# Altium schematic sheet USB.SchDoc
size D; SheetNumber: 5; SheetTotal: 11
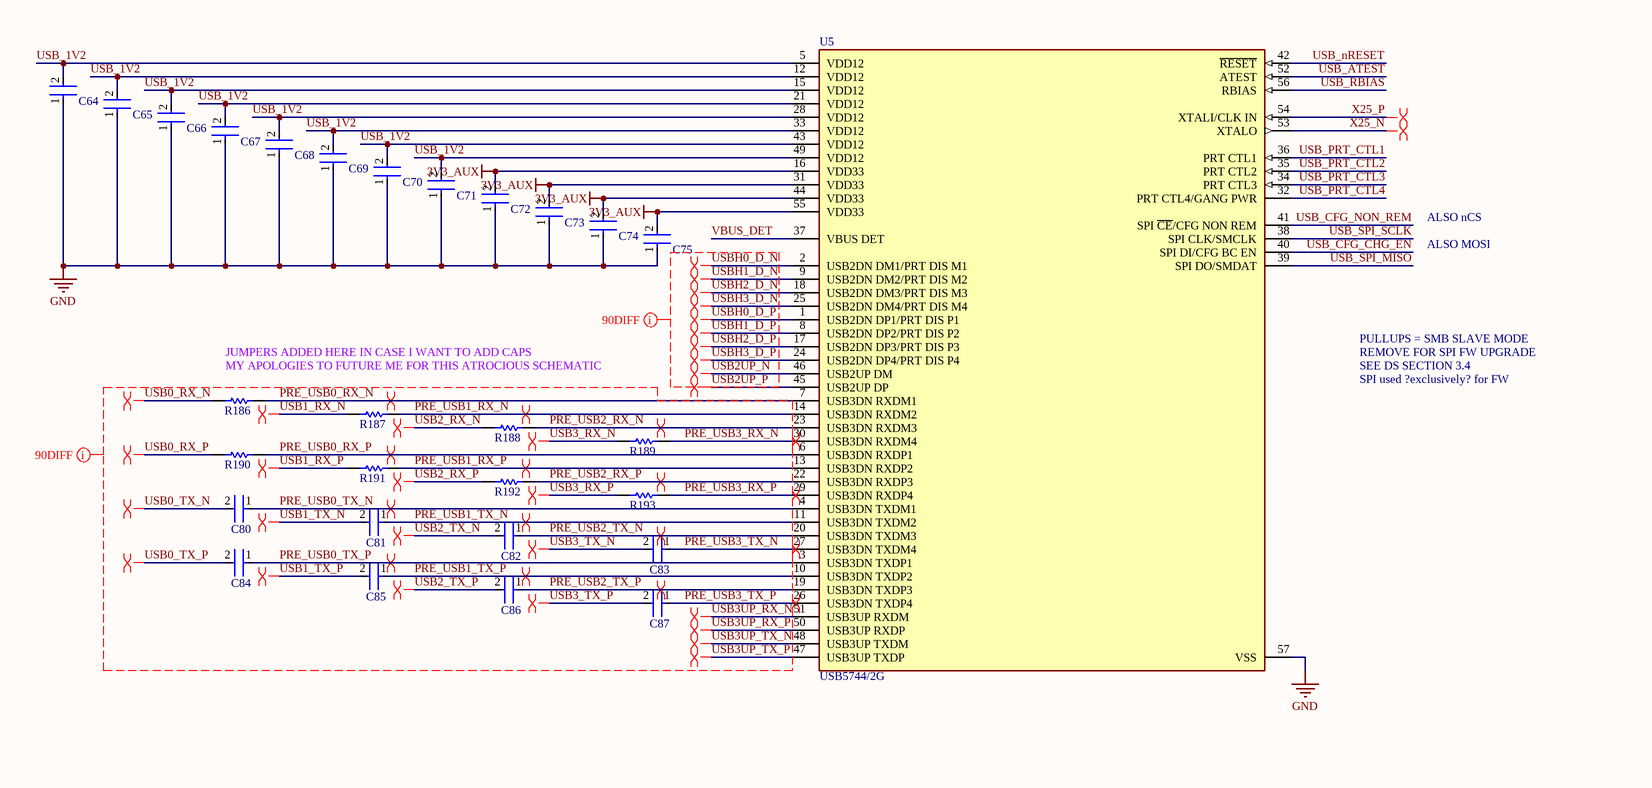
[diagram p0: USB.SchDoc, top left]
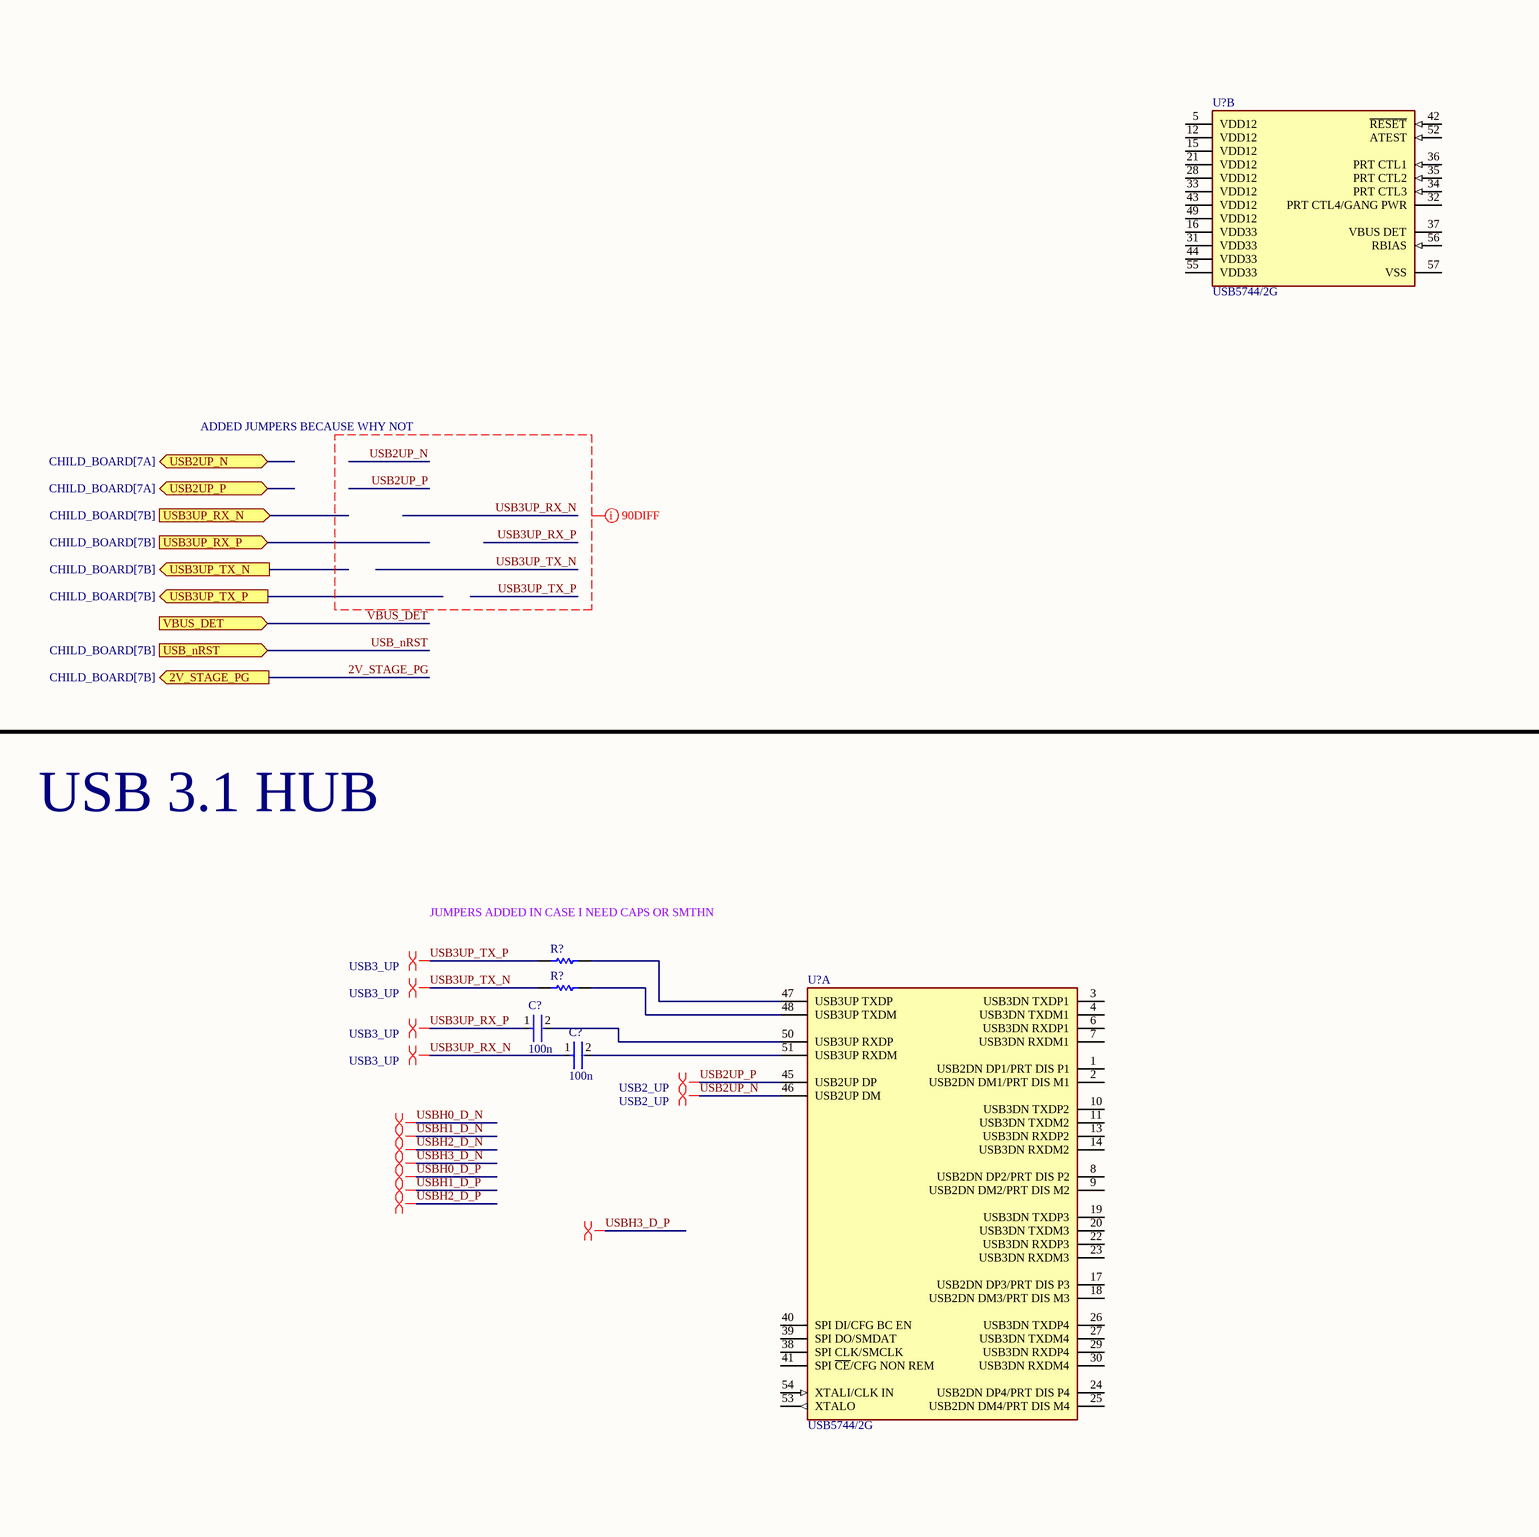
[diagram p1: USB.SchDoc, top middle]
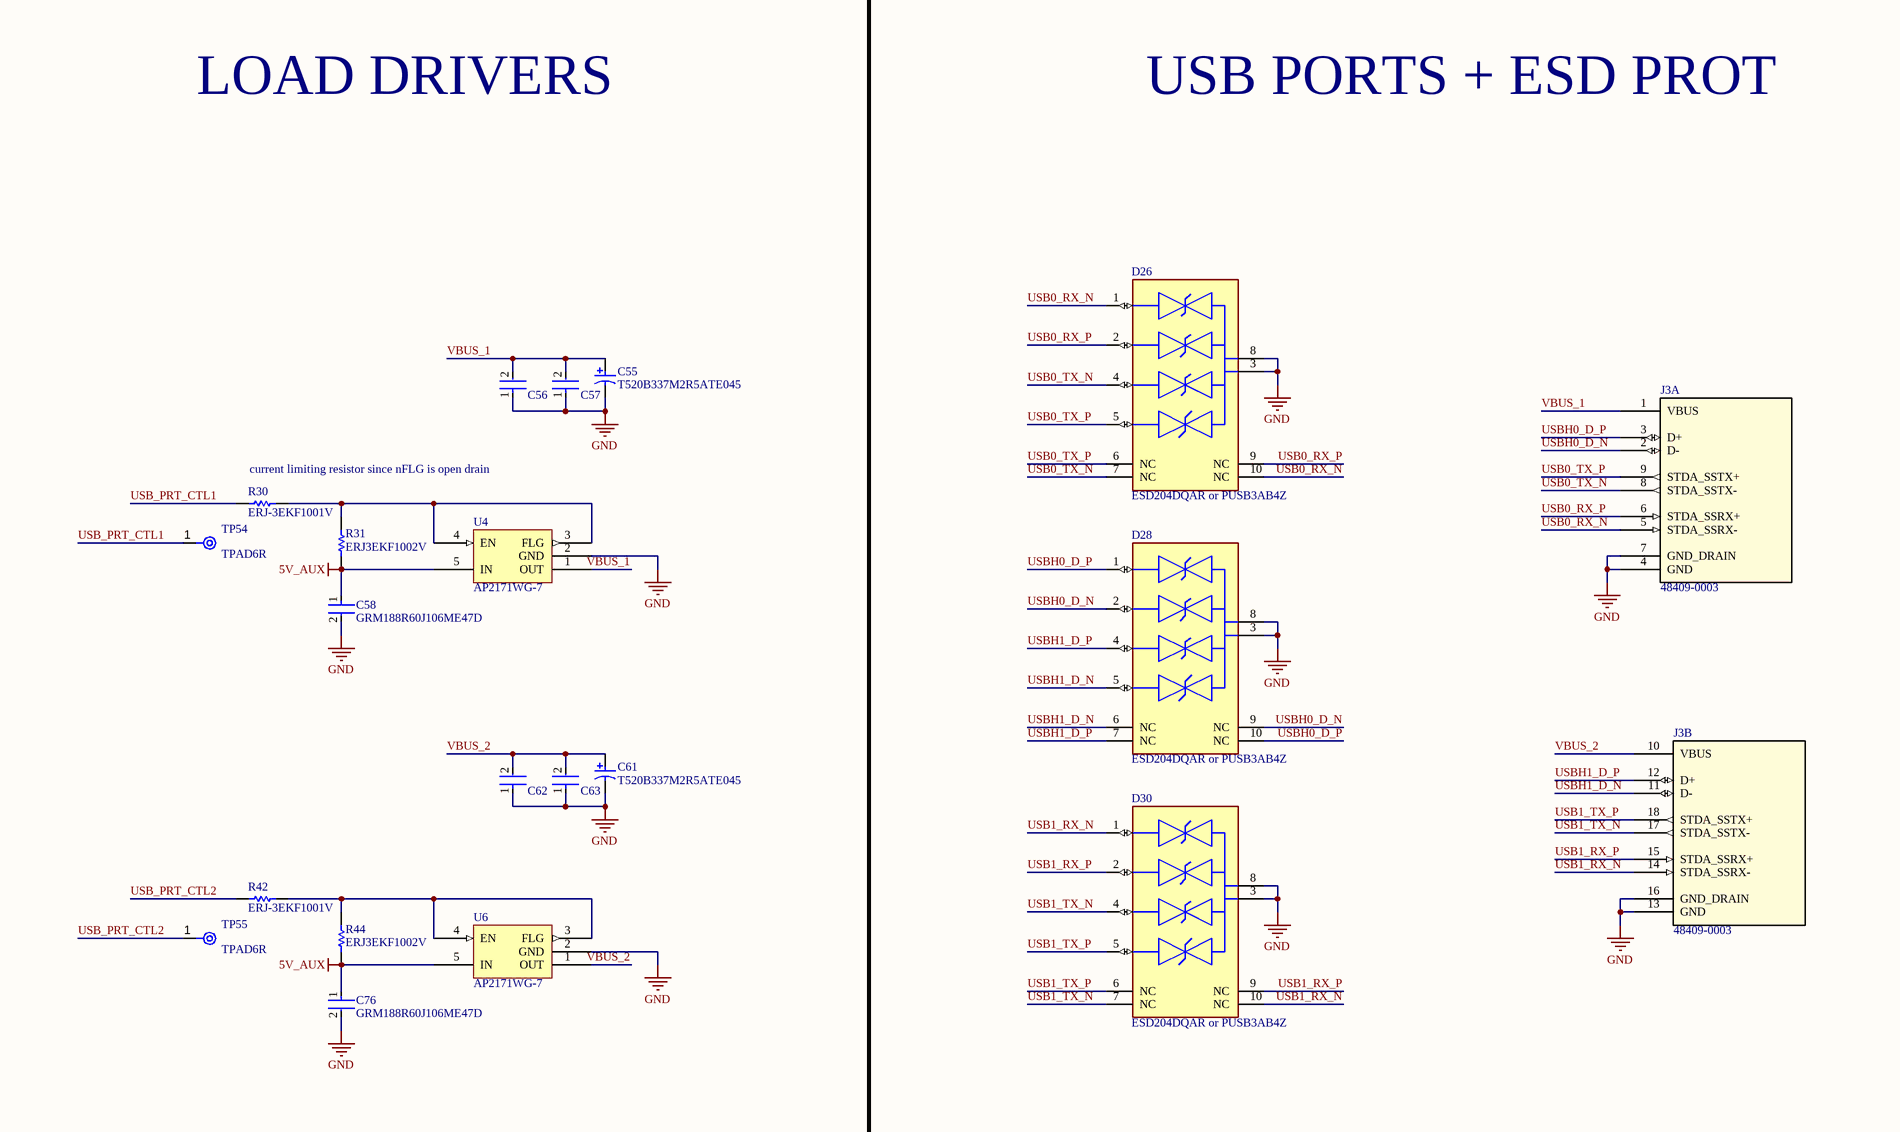
[diagram p2: USB.SchDoc, top right]
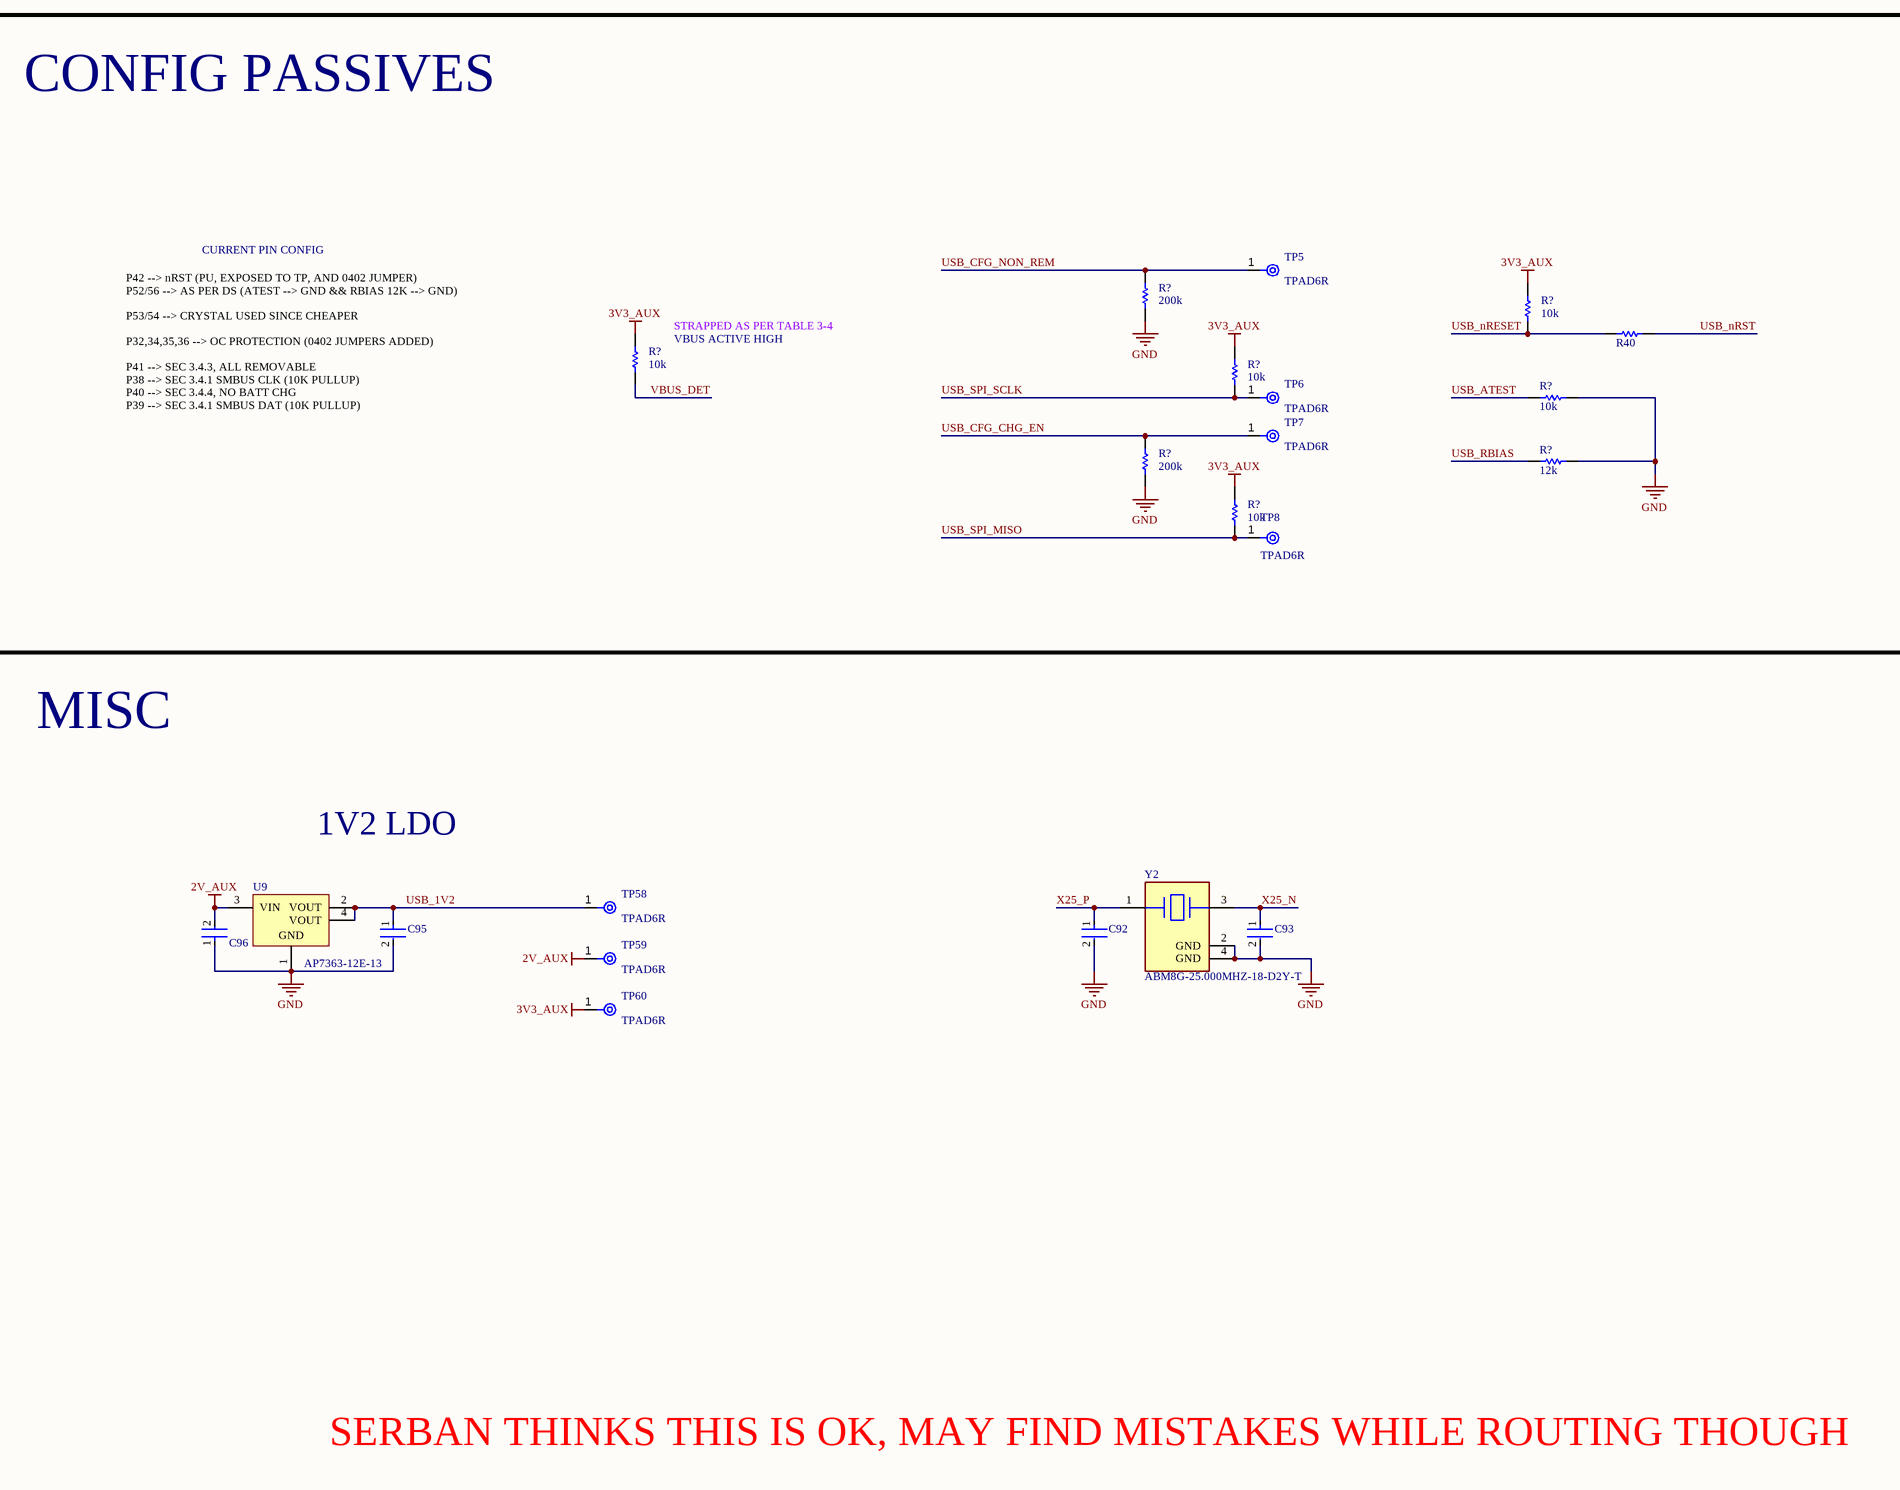
[diagram p3: USB.SchDoc, bottom middle]
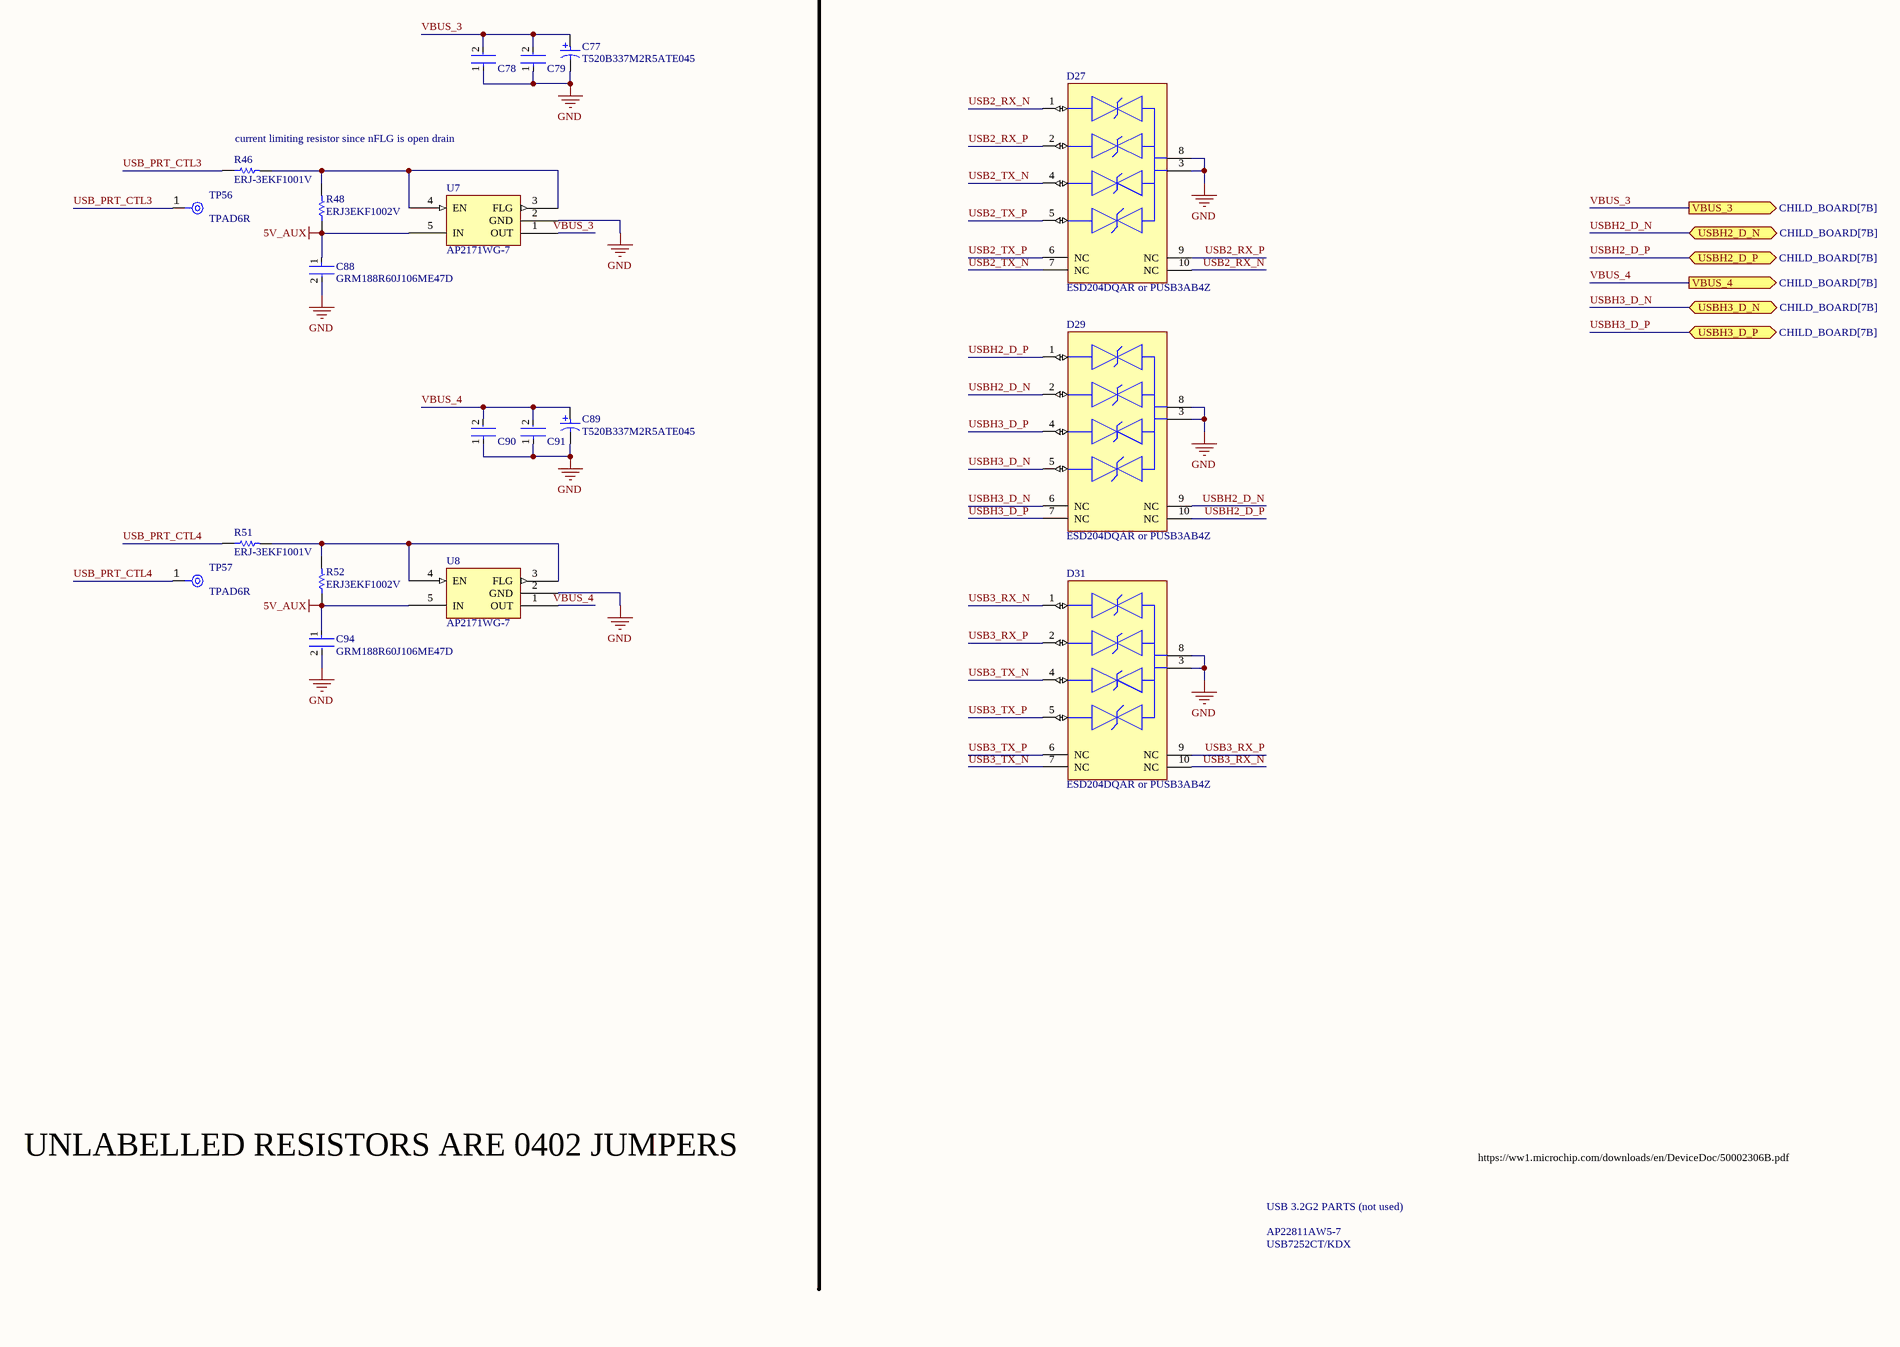
[diagram p4: USB.SchDoc, bottom right]

## Parts
(Parts that share a designator on the sheet are numbered #1, #2 ... from top to bottom, then left to right.)
C55  T520B337M2R5ATE045  [KEMT-520-B-2_M]
C56  C1005X7R1H104K050BB  [FP-C1005-050-0_05-IPC_C]  (value not drawn)
C57  C1005X7R1H104K050BB  [FP-C1005-050-0_05-IPC_C]  (value not drawn)
C58  GRM188R60J106ME47D  [FP-GRM188-0_1-e0_2_0_55-IPC_A]
C61  T520B337M2R5ATE045  [KEMT-520-B-2_M]
C62  C1005X7R1H104K050BB  [FP-C1005-050-0_05-IPC_C]  (value not drawn)
C63  C1005X7R1H104K050BB  [FP-C1005-050-0_05-IPC_C]  (value not drawn)
C64  C1005X7R1H104K050BB  [FP-C1005-050-0_05-IPC_C]  (value not drawn)
C65  C1005X7R1H104K050BB  [FP-C1005-050-0_05-IPC_C]  (value not drawn)
C66  C1005X7R1H104K050BB  [FP-C1005-050-0_05-IPC_C]  (value not drawn)
C67  C1005X7R1H104K050BB  [FP-C1005-050-0_05-IPC_C]  (value not drawn)
C68  C1005X7R1H104K050BB  [FP-C1005-050-0_05-IPC_C]  (value not drawn)
C69  C1005X7R1H104K050BB  [FP-C1005-050-0_05-IPC_C]  (value not drawn)
C70  C1005X7R1H104K050BB  [FP-C1005-050-0_05-IPC_C]  (value not drawn)
C71  C1005X7R1H104K050BB  [FP-C1005-050-0_05-IPC_C]  (value not drawn)
C72  C1005X7R1H104K050BB  [FP-C1005-050-0_05-IPC_C]  (value not drawn)
C73  C1005X7R1H104K050BB  [FP-C1005-050-0_05-IPC_C]  (value not drawn)
C74  C1005X7R1H104K050BB  [FP-C1005-050-0_05-IPC_C]  (value not drawn)
C75  C1005X7R1H104K050BB  [FP-C1005-050-0_05-IPC_C]  (value not drawn)
C76  GRM188R60J106ME47D  [FP-GRM188-0_1-e0_2_0_55-IPC_A]
C77  T520B337M2R5ATE045  [KEMT-520-B-2_M]
C78  C1005X7R1H104K050BB  [FP-C1005-050-0_05-IPC_C]  (value not drawn)
C79  C1005X7R1H104K050BB  [FP-C1005-050-0_05-IPC_C]  (value not drawn)
C80  C1005X7R1H104K050BB  [FP-C1005-050-0_05-IPC_C]  (value not drawn)
C81  C1005X7R1H104K050BB  [FP-C1005-050-0_05-IPC_C]  (value not drawn)
C82  C1005X7R1H104K050BB  [FP-C1005-050-0_05-IPC_C]  (value not drawn)
C83  C1005X7R1H104K050BB  [FP-C1005-050-0_05-IPC_C]  (value not drawn)
C84  C1005X7R1H104K050BB  [FP-C1005-050-0_05-IPC_C]  (value not drawn)
C85  C1005X7R1H104K050BB  [FP-C1005-050-0_05-IPC_C]  (value not drawn)
C86  C1005X7R1H104K050BB  [FP-C1005-050-0_05-IPC_C]  (value not drawn)
C87  C1005X7R1H104K050BB  [FP-C1005-050-0_05-IPC_C]  (value not drawn)
C88  GRM188R60J106ME47D  [FP-GRM188-0_1-e0_2_0_55-IPC_A]
C89  T520B337M2R5ATE045  [KEMT-520-B-2_M]
C90  C1005X7R1H104K050BB  [FP-C1005-050-0_05-IPC_C]  (value not drawn)
C91  C1005X7R1H104K050BB  [FP-C1005-050-0_05-IPC_C]  (value not drawn)
C92  C0603C300J5GACTU  [FP-C0603C-CF-MFG]  (value not drawn)
C93  C0603C300J5GACTU  [FP-C0603C-CF-MFG]  (value not drawn)
C94  GRM188R60J106ME47D  [FP-GRM188-0_1-e0_2_0_55-IPC_A]
C95  GRM188R60J106ME47D  [FP-GRM188-0_1-e0_2_0_55-IPC_A]  (value not drawn)
C96  C1005X7R1H104K050BB  [FP-C1005-050-0_05-IPC_C]  (value not drawn)
C?#1  100n  [FP-0402-L_1_0_0_05-W_0_5-IPC_A]
C?#2  100n  [FP-0402-L_1_0_0_05-W_0_5-IPC_A]
D26  ESD204DQAR or PUSB3AB4Z  [FP-DQA0010A-MFG]
D27  ESD204DQAR or PUSB3AB4Z  [FP-DQA0010A-MFG]
D28  ESD204DQAR or PUSB3AB4Z  [FP-DQA0010A-MFG]
D29  ESD204DQAR or PUSB3AB4Z  [FP-DQA0010A-MFG]
D30  ESD204DQAR or PUSB3AB4Z  [FP-DQA0010A-MFG]
D31  ESD204DQAR or PUSB3AB4Z  [FP-DQA0010A-MFG]
J3  48409-0003  [48409-0003-Footprint-1]  (parts A,B of 2)
R30  ERJ-3EKF1001V  [RESC1608X55X30LL15T15]
R31  ERJ3EKF1002V  [RESC1609X55X30LL15T15]
R40  0402 JUMPER  [RESC1005X40X25ML05T05]  (value not drawn)
R42  ERJ-3EKF1001V  [RESC1608X55X30LL15T15]
R44  ERJ3EKF1002V  [RESC1609X55X30LL15T15]
R46  ERJ-3EKF1001V  [RESC1608X55X30LL15T15]
R48  ERJ3EKF1002V  [RESC1609X55X30LL15T15]
R51  ERJ-3EKF1001V  [RESC1608X55X30LL15T15]
R52  ERJ3EKF1002V  [RESC1609X55X30LL15T15]
R186  0402 JUMPER  [RESC1005X40X25ML05T05]  (value not drawn)
R187  0402 JUMPER  [RESC1005X40X25ML05T05]  (value not drawn)
R188  0402 JUMPER  [RESC1005X40X25ML05T05]  (value not drawn)
R189  0402 JUMPER  [RESC1005X40X25ML05T05]  (value not drawn)
R190  0402 JUMPER  [RESC1005X40X25ML05T05]  (value not drawn)
R191  0402 JUMPER  [RESC1005X40X25ML05T05]  (value not drawn)
R192  0402 JUMPER  [RESC1005X40X25ML05T05]  (value not drawn)
R193  0402 JUMPER  [RESC1005X40X25ML05T05]  (value not drawn)
R?#1  0402 JUMPER  [RESC1005X40X25ML05T05]  (value not drawn)
R?#2  0402 JUMPER  [RESC1005X40X25ML05T05]  (value not drawn)
R?#3  200k  [R0603B]
R?#4  10k  [R0603B]
R?#5  10k  [R0603B]
R?#6  10k  [R0603B]
R?#7  10k  [R0603B]
R?#8  200k  [R0603B]
R?#9  12k  [R0603B]
R?#10  10k  [R0603B]
TP5  TPAD6R  [New footprint 1]
TP6  TPAD6R  [New footprint 1]
TP7  TPAD6R  [New footprint 1]
TP8  TPAD6R  [New footprint 1]
TP54  TPAD6R  [New footprint 1]
TP55  TPAD6R  [New footprint 1]
TP56  TPAD6R  [New footprint 1]
TP57  TPAD6R  [New footprint 1]
TP58  TPAD6R  [New footprint 1]
TP59  TPAD6R  [New footprint 1]
TP60  TPAD6R  [New footprint 1]
U4  AP2171WG-7  [SOT95P285X130-5N]
U5  USB5744/2G  [FP-USB5744-2G-MFG]
U6  AP2171WG-7  [SOT95P285X130-5N]
U7  AP2171WG-7  [SOT95P285X130-5N]
U8  AP2171WG-7  [SOT95P285X130-5N]
U9  AP7363-12E-13  [SOT-223_M]
U?#1  USB5744/2G  [FP-USB5744-2G-IPC_A]  (part B of 2)
U?#2  USB5744/2G  [FP-USB5744-2G-IPC_A]  (part A of 2)
Y2  ABM8G-25.000MHZ-18-D2Y-T  [FP-ABM8G-MFG]

## Ports
2V_STAGE_PG (out, see CHILD_BOARD[7B]), USB2UP_N (bidir, see CHILD_BOARD[7A]), USB2UP_P (bidir, see CHILD_BOARD[7A]), USB3UP_RX_N (in, see CHILD_BOARD[7B]), USB3UP_RX_P (in, see CHILD_BOARD[7B]), USB3UP_TX_N (out, see CHILD_BOARD[7B]), USB3UP_TX_P (out, see CHILD_BOARD[7B]), USB_nRST (in, see CHILD_BOARD[7B]), USBH2_D_N (bidir, see CHILD_BOARD[7B]), USBH2_D_P (bidir, see CHILD_BOARD[7B]), USBH3_D_N (bidir, see CHILD_BOARD[7B]), USBH3_D_P (bidir, see CHILD_BOARD[7B]), VBUS_3 (out, see CHILD_BOARD[7B]), VBUS_4 (out, see CHILD_BOARD[7B]), VBUS_DET (in)

## Nets
2V_AUX: C96.2 TP59.1(TP) U9.3(VIN)
3V3_AUX: C72.2 C73.2 C74.2 C75.2 R?#4.2 R?#5.2 R?#6.2 R?#10.2 TP60.1(TP) U5.16(VDD33) U5.31(VDD33) U5.44(VDD33) U5.55(VDD33)
5V_AUX: C58.1 C76.1 C88.1 C94.1 R31.1 R44.1 R48.1 R52.1 U4.5(IN) U6.5(IN) U7.5(IN) U8.5(IN)
GND: C55.2 C56.1 C57.1 C58.2 C61.2 C62.1 C63.1 C64.1 C65.1 C66.1 C67.1 C68.1 C69.1 C70.1 C71.1 C72.1 C73.1 C74.1 C75.1 C76.2 C77.2 C78.1 C79.1 C88.2 C89.2 C90.1 C91.1 C92.2 C93.2 C94.2 C95.2 C96.1 D26.3(GND) D26.8(GND) D27.3(GND) D27.8(GND) D28.3(GND) D28.8(GND) D29.3(GND) D29.8(GND) D30.3(GND) D30.8(GND) D31.3(GND) D31.8(GND) J3.4(GND) J3.7(GND_DRAIN) J3.13(GND) J3.16(GND_DRAIN) R?#3.1 R?#7.1 R?#8.1 R?#9.1 U4.2(GND) U5.57(VSS) U6.2(GND) U7.2(GND) U8.2(GND) U9.1(GND) Y2.2(GND) Y2.4(GND)
2V_STAGE_PG: port 2V_STAGE_PG
PRE_USB0_RX_N: R186.2 U5.7(USB3DN_RXDM1)
PRE_USB0_RX_P: R190.2 U5.6(USB3DN_RXDP1)
PRE_USB0_TX_N: C80.1 U5.4(USB3DN_TXDM1)
PRE_USB0_TX_P: C84.1 U5.3(USB3DN_TXDP1)
PRE_USB1_RX_N: R187.2 U5.14(USB3DN_RXDM2)
PRE_USB1_RX_P: R191.2 U5.13(USB3DN_RXDP2)
PRE_USB1_TX_N: C81.1 U5.11(USB3DN_TXDM2)
PRE_USB1_TX_P: C85.1 U5.10(USB3DN_TXDP2)
PRE_USB2_RX_N: R188.2 U5.23(USB3DN_RXDM3)
PRE_USB2_RX_P: R192.2 U5.22(USB3DN_RXDP3)
PRE_USB2_TX_N: C82.1 U5.20(USB3DN_TXDM3)
PRE_USB2_TX_P: C86.1 U5.19(USB3DN_TXDP3)
PRE_USB3_RX_N: R189.2 U5.30(USB3DN_RXDM4)
PRE_USB3_RX_P: R193.2 U5.29(USB3DN_RXDP4)
PRE_USB3_TX_N: C83.1 U5.27(USB3DN_TXDM4)
PRE_USB3_TX_P: C87.1 U5.26(USB3DN_TXDP4)
USB0_RX_N: D26.1(IO1) D26.10(NC) J3.5(STDA_SSRX-) R186.1
USB0_RX_P: D26.2(IO2) D26.9(NC) J3.6(STDA_SSRX+) R190.1
USB0_TX_N: C80.2 D26.4(IO3) D26.7(NC) J3.8(STDA_SSTX-)
USB0_TX_P: C84.2 D26.5(IO4) D26.6(NC) J3.9(STDA_SSTX+)
USB1_RX_N: D30.1(IO1) D30.10(NC) J3.14(STDA_SSRX-) R187.1
USB1_RX_P: D30.2(IO2) D30.9(NC) J3.15(STDA_SSRX+) R191.1
USB1_TX_N: C81.2 D30.4(IO3) D30.7(NC) J3.17(STDA_SSTX-)
USB1_TX_P: C85.2 D30.5(IO4) D30.6(NC) J3.18(STDA_SSTX+)
USB2_RX_N: D27.1(IO1) D27.10(NC) R188.1
USB2_RX_P: D27.2(IO2) D27.9(NC) R192.1
USB2_TX_N: C82.2 D27.4(IO3) D27.7(NC)
USB2_TX_P: C86.2 D27.5(IO4) D27.6(NC)
USB2UP_N: U5.46(USB2UP_DM) U?#2.46(USB2UP_DM)
USB2UP_P: U5.45(USB2UP_DP) U?#2.45(USB2UP_DP)
USB3_RX_N: D31.1(IO1) D31.10(NC) R189.1
USB3_RX_P: D31.2(IO2) D31.9(NC) R193.1
USB3_TX_N: C83.2 D31.4(IO3) D31.7(NC)
USB3_TX_P: C87.2 D31.5(IO4) D31.6(NC)
USB3UP_RX_N: C?#2.1 U5.51(USB3UP_RXDM)
USB3UP_RX_P: C?#1.1 U5.50(USB3UP_RXDP)
USB3UP_TX_N: R?#2.1 U5.48(USB3UP_TXDM)
USB3UP_TX_P: R?#1.1 U5.47(USB3UP_TXDP)
USB_1V2: C64.2 C65.2 C66.2 C67.2 C68.2 C69.2 C70.2 C71.2 C95.1 TP58.1(TP) U5.5(VDD12) U5.12(VDD12) U5.15(VDD12) U5.21(VDD12) U5.28(VDD12) U5.33(VDD12) U5.43(VDD12) U5.49(VDD12) U9.2(VOUT) U9.4(VOUT)
USB_ATEST: R?#7.2 U5.52(ATEST)
USB_CFG_CHG_EN: R?#8.2 TP7.1(TP) U5.40(SPI_DI/CFG_BC_EN)
USB_CFG_NON_REM: R?#3.2 TP5.1(TP) U5.41(SPI_~{CE}/CFG_NON_REM)
USB_nRESET: R40.1 R?#4.1 U5.42(~{RESET})
USB_nRST: R40.2 ; port USB_nRST
USB_PRT_CTL1: R30.1 TP54.1(TP) U5.36(PRT_CTL1)
USB_PRT_CTL2: R42.1 TP55.1(TP) U5.35(PRT_CTL2)
USB_PRT_CTL3: R46.1 TP56.1(TP) U5.34(PRT_CTL3)
USB_PRT_CTL4: R51.1 TP57.1(TP) U5.32(PRT_CTL4/GANG_PWR)
USB_RBIAS: R?#9.2 U5.56(RBIAS)
USB_SPI_MISO: R?#10.1 TP8.1(TP) U5.39(SPI_DO/SMDAT)
USB_SPI_SCLK: R?#6.1 TP6.1(TP) U5.38(SPI_CLK/SMCLK)
USBH0_D_N: D28.2(IO2) D28.9(NC) J3.2(D-) U5.2(USB2DN_DM1/PRT_DIS_M1)
USBH0_D_P: D28.1(IO1) D28.10(NC) J3.3(D+) U5.1(USB2DN_DP1/PRT_DIS_P1)
USBH1_D_N: D28.5(IO4) D28.6(NC) J3.11(D-) U5.9(USB2DN_DM2/PRT_DIS_M2)
USBH1_D_P: D28.4(IO3) D28.7(NC) J3.12(D+) U5.8(USB2DN_DP2/PRT_DIS_P2)
USBH2_D_N: D29.2(IO2) D29.9(NC) U5.18(USB2DN_DM3/PRT_DIS_M3) ; port USBH2_D_N
USBH2_D_P: D29.1(IO1) D29.10(NC) U5.17(USB2DN_DP3/PRT_DIS_P3) ; port USBH2_D_P
USBH3_D_N: D29.5(IO4) D29.6(NC) U5.25(USB2DN_DM4/PRT_DIS_M4) ; port USBH3_D_N
USBH3_D_P: D29.4(IO3) D29.7(NC) U5.24(USB2DN_DP4/PRT_DIS_P4) ; port USBH3_D_P
VBUS_1: C55.1 C56.2 C57.2 J3.1(VBUS) U4.1(OUT)
VBUS_2: C61.1 C62.2 C63.2 J3.10(VBUS) U6.1(OUT)
VBUS_3: C77.1 C78.2 C79.2 U7.1(OUT) ; port VBUS_3
VBUS_4: C89.1 C90.2 C91.2 U8.1(OUT) ; port VBUS_4
VBUS_DET: R?#5.1 U5.37(VBUS_DET) ; port VBUS_DET
X25_N: C93.1 U5.53(XTALO) Y2.3
X25_P: C92.1 U5.54(XTALI/CLK_IN) Y2.1
NetC?#1_2: C?#1.2 U?#2.50(USB3UP_RXDP)
NetC?#2_2: C?#2.2 U?#2.51(USB3UP_RXDM)
NetR30_2: R30.2 R31.2 U4.3(FLG) U4.4(EN)
NetR42_2: R42.2 R44.2 U6.3(FLG) U6.4(EN)
NetR46_2: R46.2 R48.2 U7.3(FLG) U7.4(EN)
NetR51_2: R51.2 R52.2 U8.3(FLG) U8.4(EN)
NetR?#1_2: R?#1.2 U?#2.47(USB3UP_TXDP)
NetR?#2_2: R?#2.2 U?#2.48(USB3UP_TXDM)

Not connected (* = marked no-connect by the designer): U?#1 5(VDD12) 12(VDD12) 15(VDD12) 16(VDD33) 21(VDD12) 28(VDD12) 31(VDD33) 32(PRT_CTL4/GANG_PWR) 33(VDD12) 34(PRT_CTL3) 35(PRT_CTL2) 36(PRT_CTL1) 37(VBUS_DET) 42(~{RESET}) 43(VDD12) 44(VDD33) 49(VDD12) 52(ATEST) 55(VDD33) 56(RBIAS) 57(VSS); U?#2 1(USB2DN_DP1/PRT_DIS_P1) 2(USB2DN_DM1/PRT_DIS_M1) 3(USB3DN_TXDP1) 4(USB3DN_TXDM1) 6(USB3DN_RXDP1) 7(USB3DN_RXDM1) 8(USB2DN_DP2/PRT_DIS_P2) 9(USB2DN_DM2/PRT_DIS_M2) 10(USB3DN_TXDP2) 11(USB3DN_TXDM2) 13(USB3DN_RXDP2) 14(USB3DN_RXDM2) 17(USB2DN_DP3/PRT_DIS_P3) 18(USB2DN_DM3/PRT_DIS_M3) 19(USB3DN_TXDP3) 20(USB3DN_TXDM3) 22(USB3DN_RXDP3) 23(USB3DN_RXDM3) 24(USB2DN_DP4/PRT_DIS_P4) 25(USB2DN_DM4/PRT_DIS_M4) 26(USB3DN_TXDP4) 27(USB3DN_TXDM4) 29(USB3DN_RXDP4) 30(USB3DN_RXDM4) 38(SPI_CLK/SMCLK) 39(SPI_DO/SMDAT) 40(SPI_DI/CFG_BC_EN) 41(SPI_~{CE}/CFG_NON_REM) 53(XTALO) 54(XTALI/CLK_IN)

## Layout directives
differential pair; differential pair class 90DIFF: PRE_USB0_RX_N, PRE_USB0_RX_P, PRE_USB0_TX_N, PRE_USB0_TX_P, PRE_USB1_RX_N, PRE_USB1_RX_P, PRE_USB1_TX_N, PRE_USB1_TX_P, PRE_USB2_RX_N, PRE_USB2_RX_P, PRE_USB2_TX_N, PRE_USB2_TX_P, PRE_USB3_RX_N, PRE_USB3_RX_P, PRE_USB3_TX_N, PRE_USB3_TX_P, USB0_RX_N, USB0_RX_P, USB0_TX_N, USB0_TX_P, USB1_RX_N, USB1_RX_P, USB1_TX_N, USB1_TX_P, USB2_RX_N, USB2_RX_P, USB2_TX_N, USB2_TX_P, USB2UP_N, USB2UP_P, USB3_RX_N, USB3_RX_P, USB3_TX_N, USB3_TX_P, USB3UP_RX_N, USB3UP_RX_P, USB3UP_TX_N, USB3UP_TX_P, USBH0_D_N, USBH0_D_P, USBH1_D_N, USBH1_D_P, USBH2_D_N, USBH2_D_P, USBH3_D_N, USBH3_D_P
differential pair: X25_N, X25_P
net class 90DIFF: PRE_USB0_RX_N, PRE_USB0_RX_P, PRE_USB0_TX_N, PRE_USB0_TX_P, PRE_USB1_RX_N, PRE_USB1_RX_P, PRE_USB1_TX_N, PRE_USB1_TX_P, PRE_USB2_RX_N, PRE_USB2_RX_P, PRE_USB2_TX_N, PRE_USB2_TX_P, PRE_USB3_RX_N, PRE_USB3_RX_P, PRE_USB3_TX_N, PRE_USB3_TX_P, USB0_RX_N, USB0_RX_P, USB0_TX_N, USB0_TX_P, USB1_RX_N, USB1_RX_P, USB1_TX_N, USB1_TX_P, USB2_RX_N, USB2_RX_P, USB2_TX_N, USB2_TX_P, USB2UP_N, USB2UP_P, USB3_RX_N, USB3_RX_P, USB3_TX_N, USB3_TX_P, USB3UP_RX_N, USB3UP_RX_P, USB3UP_TX_N, USB3UP_TX_P, USBH0_D_N, USBH0_D_P, USBH1_D_N, USBH1_D_P, USBH2_D_N, USBH2_D_P, USBH3_D_N, USBH3_D_P
differential pair; differential pair class USB2_UP: USB2UP_N, USB2UP_P
differential pair; differential pair class USB3_UP: USB3UP_RX_N, USB3UP_RX_P, USB3UP_TX_N, USB3UP_TX_P

## Notes on the sheet
- ALSO nCS
- ALSO MOSI
- JUMPERS ADDED HERE IN CASE I WANT TO ADD CAPS
- MY APOLOGIES TO FUTURE ME FOR THIS ATROCIOUS SCHEMATIC
- SPI used ?exclusively? for FW
- PULLUPS = SMB SLAVE MODE
- REMOVE FOR SPI FW UPGRADE
- SEE DS SECTION 3.4
- ADDED JUMPERS BECAUSE WHY NOT
- LOAD DRIVERS
- USB PORTS + ESD PROT
- USB 3.1 HUB
- (near R?#1) JUMPERS ADDED IN CASE I NEED CAPS OR SMTHN
- (near R30) current limiting resistor since nFLG is open drain
- CONFIG PASSIVES
- (near R46) current limiting resistor since nFLG is open drain
- CURRENT PIN CONFIG
- (near R?#5) VBUS ACTIVE HIGH
- (near R?#5) STRAPPED AS PER TABLE 3-4
- P42 --> nRST (PU, EXPOSED TO TP, AND 0402 JUMPER)
  P52/56 --> AS PER DS (ATEST --> GND && RBIAS 12K --> GND)
  P53/54 --> CRYSTAL USED SINCE CHEAPER
  P32,34,35,36 --> OC PROTECTION (0402 JUMPERS ADDED)
  P41 --> SEC 3.4.3, ALL REMOVABLE
  P38 --> SEC 3.4.1 SMBUS CLK (10K PULLUP)
  P40 --> SEC 3.4.4, NO BATT CHG
  P39 --> SEC 3.4.1 SMBUS DAT (10K PULLUP)
- MISC
- 1V2 LDO
- UNLABELLED RESISTORS ARE 0402 JUMPERS
- https://ww1.microchip.com/downloads/en/DeviceDoc/50002306B.pdf
- USB 3.2G2 PARTS (not used)
- AP22811AW5-7
- USB7252CT/KDX
- SERBAN THINKS THIS IS OK, MAY FIND MISTAKES WHILE ROUTING THOUGH

## Library data of the parts
C55 C61 C77 C89 = CMP-1664-00002-2: Tantalum Capacitor, 330 uF, +/- 20%, 2.5 V, -55 to 105 degC, 2-Pin Molded, RoHS, Tape and Reel; Capacitance: 330 uF; PartNumber: T520B337M2R5ATE045; DatasheetVersion: 07/2016; Radiation Hardening: No; ComponentLink2Description: Datasheet; PackageDescription: 2-Pin Surface Mount Device, Body 3.5 x 2.8 mm; Width: 2.8 mm; ComponentLink2URL: http://capacitoredge.kemet.com/capedge2/DataSheet?pn=T520B337M2R5ATE045; Case/Package: 1411; Length: 3.5 mm; Package Quantity: 2000; Max Operating Temperature: 105 degC; Mounting Technology: Surface Mount; Height: 2.1 mm; RoHSCompliant: True; ComponentLink1URL: http://www.kemet.com/; Mount: Surface Mount; Packaging: Tape and Reel; ComponentLink1Description: Manufacturer URL; Min Operating Temperature: -55 degC
C56 C57 C62-C75 C78-C87 C90 C91 C96 = CMP-2000-05393-2: Multilayer Ceramic Capacitors 100nF ±10% 50V X7R SMD 0402; Voltage: 50V; Dielectric Material: Ceramic; Min Operating Temperature: -55°C; Depth: 0.5mm; Radiation Hardening: No; RoHS Compliant: Yes; Voltage Rating (DC): 50V; Lead Free: Lead Free; Resistor Type: Ceramic; Height: 0.5mm; Dielectric: X7R; Thickness: 0.022inch; Case/Package: 0402; Case Code (Metric): 1005; Termination: SMD/SMT; Capacitance: 100nF; Packaging: Tape and Reel; Max Operating Temperature: 125°C; Mount: Surface Mount; Package Quantity: 1; Width: 0.02inch; Weight: 2.3E-05oz; Voltage Rating: 50V; Tolerance: 10%; Construction: Flat; Case Code (Imperial): 0402; Length: 1mm; REACH SVHC: No SVHC; Series: C
C58 C76 C88 C94 C95 = CMP-2006-02792-2: Chip Multilayer Ceramic Capacitors for General Purpose, 0603, 10uF, X5R, 15%, 20%, 6.3V; Packaging: Tape and Reel; Voltage Rating (DC): 6.3V; Width: 0.031inch; Termination: SMD/SMT; Dielectric: X5R; Package Quantity: 4000; Voltage Rating: 6.3V; Capacitance: 10uF; Case/Package: 0603; Min Operating Temperature: -55°C; Voltage: 6.3V; Length: 1.6mm; Thickness: 0.035inch; Lead Free: Lead Free; Depth: 0.8mm; Case Code (Imperial): 0603; Max Operating Temperature: 85°C; Material: Ceramic; Height: 0.8mm; Tolerance: 20%; Mount: Surface Mount; REACH SVHC: No SVHC; Radiation Hardening: No; Case Code (Metric): 1608
C92 C93 = CMP-1035-00914-3: CAP CER 30PF 50V 5% NP0 0603; Manufacturer: KEMET; Automotive Grade: Grade 1; Temperature Coefficient: 30ppm/°C; Material: Ceramic; Temperature Characteristic: C0G; Tolerance: 0.05; Manufacturer Part Number: C0603C300J5GACTU; ComponentLink2URL: https://api.kemet.com/component-edge/download/datasheet/C0603C100J5GACAUTO.pdf; Automotive: Yes; Device Class L2: Capacitors; Device Class L1: Passive Components; Device Class L3: Ceramic Capacitors; RoHS: TRUE; Octopart: https://octopart.com/c0603c300j5gactu-kemet-199455; Lead Free: Yes; Value: 30 pF; Temperature Range High: +125°C; Category: Cap; Temperature: -55°C to +125°C; Package: C0603C-CF; Capacitance: 30 pF; Digikey Description: CAP CER 30PF 50V 5% NP0 0603; Height: 0.87mm; ComponentLink2Description: Datasheet; Temperature Range Low: -55°C; Mouser Description: Multilayer Ceramic Capacitors MLCC - SMD/SMT 50volts 30pF C0G 5%; Voltage Rating: 50 V
C?#1 C?#2 = CMP-001-00058-1: LARGE PADS, 0402 CAP, CHANGE COMMENT TO MATCH REAL P/N; Capacitor Type: Ceramic; Min Operating Temperature: -55°C; Mounting Technology: Surface Mount; Pins: 2; Case/Package: 0402; RoHS Compliant: Yes; Max Operating Temperature: 85°C
D26-D31 = CMP-04989-000002-1: 4-CHANNEL LOW-CAPACITANCE SURGE; Manufacturer: Texas Instruments; Value: 0.55pF; Reverse Standoff Voltage: 3.6V; Standoff Height: 0mm; Breakdown Voltage: 5.5V; Peak Pulse Current: 5.5A; Clamping Voltage: 11.5V; Direction: Bidirectional; Peak Pulse Power: 50W; Number Of Channels: 4; Ambient Temperature Range High: +125°C; ComponentLink2Description: Datasheet; Height: 0.55mm; Lead Free: Yes; Device Class L3: unset; Temperature Range High: +125°C; Temperature Range Low: -40°C; Package: DQA0010A; Temperature: -40°C to +125°C; Capacitance: 0.55pF; RoHS: TRUE; Mouser Description: 4-Channel Low-Capacitance Surge and ESD Protection Diode 10-USON -40 to 125; Category: Diode; Device Class L1: Circuit Protection; Octopart: https://octopart.com/esd204dqar-texas+instruments-89917476; Device Class L2: TVS Diodes; Ambient Temperature Range Low: -40°C; Manufacturer Part Number: ESD204DQAR; ComponentLink2URL: http://www.ti.com/lit/ds/symlink/esd204.pdf; Automotive: No; Digikey Description: 4-CHANNEL LOW-CAPACITANCE SURGE
J3 = CMP-002-00076-1: USB Connector, 9+9 Contact(s), Female, Straight, Solder Terminal, Receptacle
R30 R42 R46 R51 = CMP-2000-00180-1: Manufacturer: Panasonic; Part Number: ERJ-3EKF1001V
R31 R44 R48 R52 = CMP-1012-00623-3: Chip Resistor, 10 KOhm, +/- 1%, 0.1 W, -55 to 155 degC, 0603 (1608 Metric), RoHS, Tape and Reel; Manufacturer: Panasonic; Voltage Rating: 75V; Case\/Package: 0603; Power Rating: 100mW; Resistance: 10KOhm; Temperature Coefficient: 100ppm\/degreesC; Number of Pins: 2; Package Reference: 603; Depth: 0.8mm; Mount: SurfaceMount; Package Description: 2-Pin Surface Mount Device, Body 1.6 x 0.85 mm; Datasheet Version: 02/2017; Length: 1.6mm; Lead Free: LeadFree; Height: 0.45mm; Number of Terminations: 2; Max Power Dissipation: 100mW; Min Operating Temperature: -55degC; Datasheet URL: https://industrial.panasonic.com/cdbs/www-data/pdf/RDA0000/AOA0000C304.pdf; Termination: SMD/SMT; Case Code (Metric): 1608; Case Code (Imperial): 0603; Tolerance: 1%; Max Operating Temperature: 155degC; RoHSCompliant: true; Voltage Rating (DC): 75V; Radiation Hardening: No; Packaging: TapeandReel; Composition: ThickFilm; Mounting Technology: SurfaceMount; Manufacturer URL: http://www.panasonic.com/; Width: 0.031inch; REACH SVHC: NoSVHC; Contact Plating: Tin; Military Standard: Not; Package Quantity: 1
R40 R186-R193 R?#1 R?#2 = CMP-009-00118-2: READ THE NAME; Pins: 2; Component Type: Standard; Design Item ID: CMP-009-00206-2; Source: 0402jump.SchLib
R?#3-R?#10 = CMP-009-00002-14: Resistor
TP5-TP8 TP54-TP60 = CMP-00025-2: Test Point .6mm
U4 U6-U8 = CMP-031-00024-2: IC PWR SW USB 1CH 1A SOT-25-5; Source: AP2171WG-7.SchLib; Component Type: Standard; Design Item ID: CMP-019-00057-1; Pins: 5
U5 = CMP-06284-000017-1: IC HUB CTLR USB 56VQFN; Min Operating Temperature: 0°C; Packaging: Tray; Lead Free: Lead Free; Interface: USB; Max Operating Temperature: 70°C
U9 = CMP-0244-00318-1: Fixed Low Drop Positive Voltage Regulator, 1.2V (pn is for 1.5A LDO), 4-Pin SOT-223, Tape and Reel; PackageDescription: 4-Pin SOT-223 Package, 6.5 x 3.5 mm Body, 2.3 mm Pitch, 7 mm Lead Span; PackageVersion: 2010; ComponentLink2Description: Datasheet; PackageReference: SOT-223; ComponentLink2URL: http://www.st.com/internet/com/TECHNICAL_RESOURCES/TECHNICAL_LITERATURE/DATASHEET/CD00000544.pdf; ComponentLink1Description: Manufacturer URL; DatasheetVersion: 1/11/2011; ComponentLink1URL: http://www.st.com
U?#1 U?#2 = CMP-015-00013-1: USB Bus Controller, CMOS; Max Supply Voltage: 1.32V; Min Supply Voltage: 1.08V; RoHS Compliant: Yes; Min Operating Temperature: 0°C; Max Operating Temperature: 70°C; Case/Package: HVQCCN; Pins: 56
Y2 = CMP-2000-05733-3: Crystal 25MHz ±20ppm (Tol) ±30ppm (Stability) 18pF FUND 60Ω 4-Pin SMD T/R; Series Resistance: 60R; Length: 3.2mm; Depth: 2.5mm; Packaging: Tape and Reel; Min Operating Temperature: -40°C; Operating Frequency: 25 MHz; Lead Free: Lead Free; Number of Pins: 4; Frequency Tolerance: 20ppm; Radiation Hardening: No; Max Operating Temperature: 85°C; Termination: SMD/SMT; Frequency Stability: 30ppm; Frequency: 25MHz; Series: ABM8G; Mount: Surface Mount; Package Quantity: 1000; Height: 0.039inch; Width: 0.098inch; Case/Package: CSMD; ESR (Equivalent Series Resistance): 60R; Load Capacitance: 18pF; Tolerance: 20ppm